# Altium project Roborboard_v0.1.PrjPCB
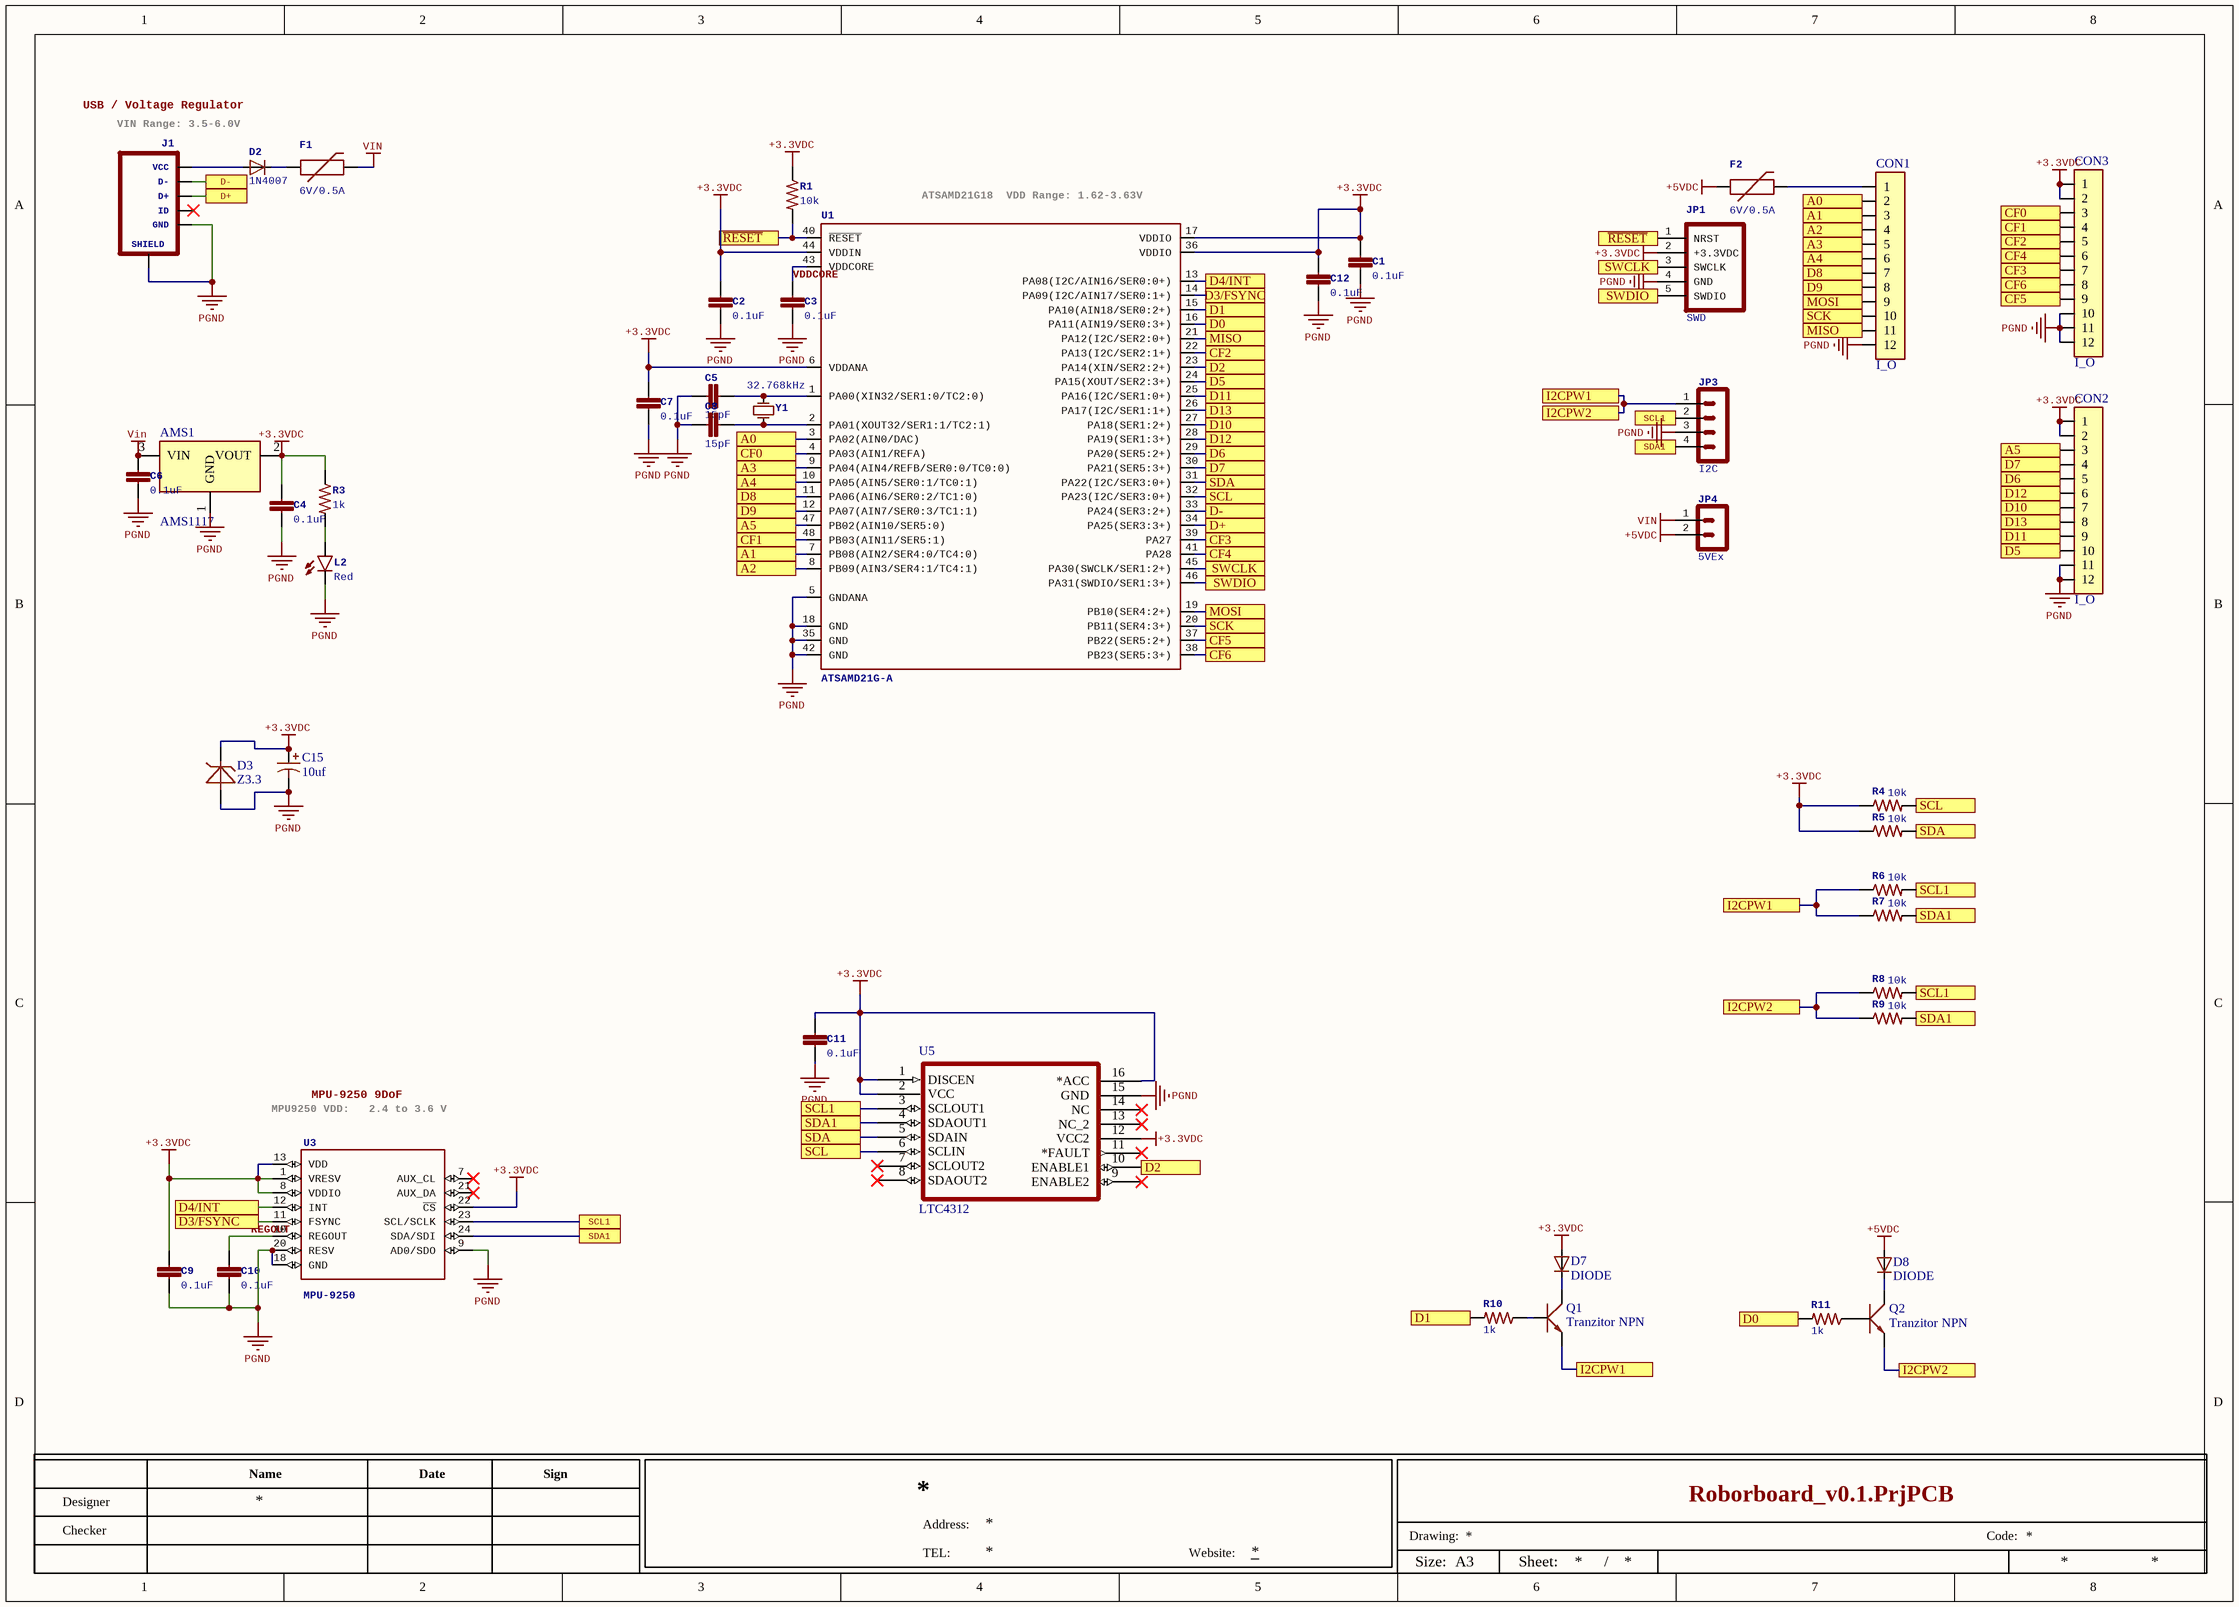
[diagram p0: Roborboard_v0.1.SchDoc]
1 sheet, 44 parts. Net scope: flat (ports and power ports of the same name join across sheets).
Board file: Roborboard_v0.1.PcbDoc

## Sheet Roborboard_v0.1.SchDoc
size A3

### Parts
AMS1  AMS1117  [SOT89]
C1  0.1uF  [CAP_SMD0603]
C2  0.1uF  [CAP_SMD0603]
C3  0.1uF  [CAP_SMD0603]
C4  0.1uF  [CAP_SMD0603]
C5  15pF  [CAP_SMD0603]
C6  0.1uF  [CAP_SMD0603]
C7  0.1uF  [CAP_SMD0603]
C8  15pF  [CAP_SMD0603]
C9  0.1uF  [CAP_SMD0603]
C10  0.1uF  [CAP_SMD0603]
C11  0.1uF  [CAP_SMD0603]
C12  0.1uF  [CAP_SMD0603]
C15  10uf  [CAP_SMD_4X4.5]
CON1  I_O  [JUMPER_12P_2.0MM]
CON2  I_O  [JUMPER_12P_2.0MM]
CON3  I_O  [JUMPER_12P_2.0MM]
D2  1N4007  [SMA]
D3  Z3.3  [DIODE_ZENER_SMD]
D7  DIODE  [SMA]
D8  DIODE  [SMA]
F1  6V/0.5A  [1206]
F2  6V/0.5A  [1206]
J1  USB_MICROB_PLUGCONN-11752  [usb_micro_xz42r]  (value not drawn)
JP1  SWD  [JUMP_5P_1.27MM]
JP3  I2C  [C3030WR-2X2P]
JP4  5VEx  [Jump_2p]
L2  Red  [LED_GREEN_3MM]
Q1  Tranzitor NPN  [SOT23]
Q2  Tranzitor NPN  [SOT23]
R1  10k  [RES_SMD0603]
R3  1k  [RES_SMD0603]
R4  10k  [RES_SMD0603]
R5  10k  [RES_SMD0603]
R6  10k  [RES_SMD0603]
R7  10k  [RES_SMD0603]
R8  10k  [RES_SMD0603]
R9  10k  [RES_SMD0603]
R10  1k  [RES_SMD0603]
R11  1k  [RES_SMD0603]
U1  ATSAMD21G-A  [LQFP 48]
U3  MPU-9250  [QFN-24]
U5  LTC4312  [MSOP-16]
Y1  32.768kHz  [CRYSTAL-SMD3.2X1.5MM]

### Ports
A0, A1, A2, A3, A4, A5, CF0, CF1, CF2, CF3, CF4, CF5, CF6, D0, D1, D2, D3/FSYNC, D4/INT, D5, D6, D7, D8, D9, D10, D11, D12, D13, D+, D-, I2CPW1, I2CPW2, MISO, MOSI, SCK, SCL, SCL1, SDA, SDA1, SWCLK, SWDIO, ~{RESET}

### Nets
+3.3VDC: AMS1.2(VOUT) C1.2 C2.2 C4.2 C7.2 C9.2 C11.2 C12.2 C15.1 CON2.1 CON2.2 CON3.1 CON3.2 D3.2 D7.1 JP1.2(+3.3VDC) R1.1 R3.1 R4.1 R5.1 U1.6(VDDANA) U1.17(VDDIO) U1.36(VDDIO) U1.44(VDDIN) U3.1(VRESV) U3.8(VDDIO) U3.13(VDD) U3.22(~{CS}) U5.1(DISCEN) U5.2(VCC) U5.12(VCC2) U5.16(*ACC)
+5VDC: D8.1 F2.1 JP4.2
PGND: AMS1.1(GND) C1.1 C2.1 C3.1 C4.1 C5.2 C6.1 C7.1 C8.2 C9.1 C10.1 C11.1 C12.1 C15.2 CON1.12 CON2.11 CON2.12 CON3.10 CON3.11 CON3.12 D3.1 J1.GND J1.S(SHIELD) JP1.4(GND) JP3.3 L2.2(POS) U1.5(GNDANA) U1.18(GND) U1.35(GND) U1.42(GND) U3.9(AD0/SDO) U3.18(GND) U3.20(RESV) U5.15(GND)
VIN: AMS1.3(VIN) C6.2 F1.2 JP4.1
REGOUT: C10.2 U3.10(REGOUT)
VDDCORE: C3.2 U1.43(VDDCORE)
NetC5_1: C5.1 U1.1(PA00(XIN32/SER1:0/TC2:0)) Y1.2(OSC2)
NetC8_1: C8.1 U1.2(PA01(XOUT32/SER1:1/TC2:1)) Y1.1(OSC1)
NetCON1_1: CON1.1 F2.2
NetCON1_2: CON1.2 U1.3(PA02(AIN0/DAC)) ; port A0
NetCON1_3: CON1.3 U1.7(PB08(AIN2/SER4:0/TC4:0)) ; port A1
NetCON1_4: CON1.4 U1.8(PB09(AIN3/SER4:1/TC4:1)) ; port A2
NetCON1_5: CON1.5 U1.9(PA04(AIN4/REFB/SER0:0/TC0:0)) ; port A3
NetCON1_6: CON1.6 U1.10(PA05(AIN5/SER0:1/TC0:1)) ; port A4
NetCON1_7: CON1.7 U1.11(PA06(AIN6/SER0:2/TC1:0)) ; port D8
NetCON1_8: CON1.8 U1.12(PA07(AIN7/SER0:3/TC1:1)) ; port D9
NetCON1_9: CON1.9 U1.19(PB10(SER4:2+)) ; port MOSI
NetCON1_10: CON1.10 U1.20(PB11(SER4:3+)) ; port SCK
NetCON1_11: CON1.11 U1.21(PA12(I2C/SER2:0+)) ; port MISO
NetCON2_3: CON2.3 U1.47(PB02(AIN10/SER5:0)) ; port A5
NetCON2_4: CON2.4 U1.30(PA21(SER5:3+)) ; port D7
NetCON2_5: CON2.5 U1.29(PA20(SER5:2+)) ; port D6
NetCON2_6: CON2.6 U1.28(PA19(SER1:3+)) ; port D12
NetCON2_7: CON2.7 U1.27(PA18(SER1:2+)) ; port D10
NetCON2_8: CON2.8 U1.26(PA17(I2C/SER1:1+)) ; port D13
NetCON2_9: CON2.9 U1.25(PA16(I2C/SER1:0+)) ; port D11
NetCON2_10: CON2.10 U1.24(PA15(XOUT/SER2:3+)) ; port D5
NetCON3_3: CON3.3 U1.4(PA03(AIN1/REFA)) ; port CF0
NetCON3_4: CON3.4 U1.48(PB03(AIN11/SER5:1)) ; port CF1
NetCON3_5: CON3.5 U1.22(PA13(I2C/SER2:1+)) ; port CF2
NetCON3_6: CON3.6 U1.41(PA28) ; port CF4
NetCON3_7: CON3.7 U1.39(PA27) ; port CF3
NetCON3_8: CON3.8 U1.38(PB23(SER5:3+)) ; port CF6
NetCON3_9: CON3.9 U1.37(PB22(SER5:2+)) ; port CF5
NetD2_1: D2.1 J1.VBUS(VCC)
NetD2_2: D2.2 F1.1
NetD7_2: D7.2 Q1.3(COLLECTOR)
NetD8_2: D8.2 Q2.3(COLLECTOR)
NetJ1_D+: J1.D+ U1.34(PA25(SER3:3+)) ; port D+
NetJ1_D-: J1.D- U1.33(PA24(SER3:2+)) ; port D-
NetJP1_1: JP1.1(NRST) R1.2 U1.40(~{RESET}) ; port ~{RESET}
NetJP1_3: JP1.3(SWCLK) U1.45(PA30(SWCLK/SER1:2+)) ; port SWCLK
NetJP1_5: JP1.5(SWDIO) U1.46(PA31(SWDIO/SER1:3+)) ; port SWDIO
NetJP3_1: JP3.1 Q1.2(EMITTER) Q2.2(EMITTER) R6.1 R7.1 R8.1 R9.1 ; port I2CPW1, port I2CPW2
NetJP3_2: JP3.2 R6.2 R8.2 U3.23(SCL/SCLK) U5.3(SCLOUT1) ; port SCL1
NetJP3_4: JP3.4 R7.2 R9.2 U3.24(SDA/SDI) U5.4(SDAOUT1) ; port SDA1
NetL2_1: L2.1(NEG) R3.2
NetQ1_1: Q1.1(BASE) R10.1
NetQ2_1: Q2.1(BASE) R11.1
NetR4_2: R4.2 U1.32(PA23(I2C/SER3:0+)) U5.6(SCLIN) ; port SCL
NetR5_2: R5.2 U1.31(PA22(I2C/SER3:0+)) U5.5(SDAIN) ; port SDA
NetR10_2: R10.2 U1.15(PA10(AIN18/SER0:2+)) ; port D1
NetR11_2: R11.2 U1.16(PA11(AIN19/SER0:3+)) ; port D0
NetU1_13: U1.13(PA08(I2C/AIN16/SER0:0+)) U3.12(INT) ; port D4/INT
NetU1_14: U1.14(PA09(I2C/AIN17/SER0:1+)) U3.11(FSYNC) ; port D3/FSYNC
NetU1_23: U1.23(PA14(XIN/SER2:2+)) U5.10(ENABLE1) ; port D2

Not connected (* = marked no-connect by the designer): J1 ID*; U3 7(AUX_CL)* 21(AUX_DA)*; U5 7(SCLOUT2)* 8(SDAOUT2)* 9(ENABLE2)* 11(*FAULT)* 13(NC_2)* 14(NC)*

### Notes on the sheet
- USB / Voltage Regulator
- VIN Range: 3.5-6.0V
- (near U1) ATSAMD21G18
  VDD Range: 1.62-3.63V
- MPU-9250 9DoF
- (near U3) MPU9250 VDD:
  2.4 to 3.6 V
- Name
- Date
- Sign
- Designer
- Checker
- Address:
- TEL:
- Website:
- Drawing:
- Size:
- A3
- Sheet:
- /
- Code:

### Library data of the parts
C1-C12 = Cap
C15 = Cap_Pol
CON1-CON3 = Connector 12p
D2 = DIODE
D3 = DIODE_ZENER: Diode
F1 F2 = Fuse
J1 = USB_MICRO: USB Micro-B connectorsSome male, some female. Watch your step!; GateName_1: G$1; SymbolName_1: MICROB-PLUG; DeviceName: CONN-11752; LibraryName: SparkFun-Connectors; DeviceSetName: USB_MICROB_PLUG; PROD_ID: CONN-11752; SHIELD: SHIELD; VCC: VCC; D-: D-; D+: D+; ID: ID; GND: GND
JP3 = Connector 4p
JP4 = Connector 2p
L2 = LED: Lighting Eminter Diode
R1 R3-R11 = Resistor
U1 = ATSAMD21G-A: Atmel SAMD21G SMART ARM-Based Microcontroller    The Atmel Â® ¦ SMART â„¢ SAM D21 is a series of low-power microcontrollers using the 32-bit ARM Â® Cortex Â® -M0+ processor, and ranging from 32- to 64-pins with up to 256KB Flash and 32KB of SRAM. The SAM D21 devices operate at a maximum frequency of 48MHz and reach 2.46 CoreMark/MHz. They are designed for simple and intuitive migration with identical peripheral modules, hex compatible code, identical linear address map and pin compatible migration paths between all devices in the product series. All devices include intelligent and flexible peripherals, Atmel Event System for inter-peripheral signaling, and support for capacitive touch button, slider and wheel user interfaces.   Datasheet SparkFun Products  SparkFun SAMD21 Mini Breakout (DEV-13664)  SparkFun SAMD21 Dev Breakout (DEV-13672); GateName_1: G$1; DeviceName: -A; PROD_ID: IC-13064; SymbolName_1: ATSAMD21G; LibraryName: SparkFun-IC-Microcontroller; DeviceSetName: ATSAMD21G
U3 = MPU-9250: 9-axis MotionTracking: 3-Axis gyroscope, 3-Axis accelerometer, 3-Axis magnetometer NC pin 19. 2-6 & 14-17 not internally connected. May be used for PCB trace routing.; PROD_ID: IC-13192; SymbolName_1: MPU-9250; LibraryName: 9dof-devboard-temp
Y1 = Crystal